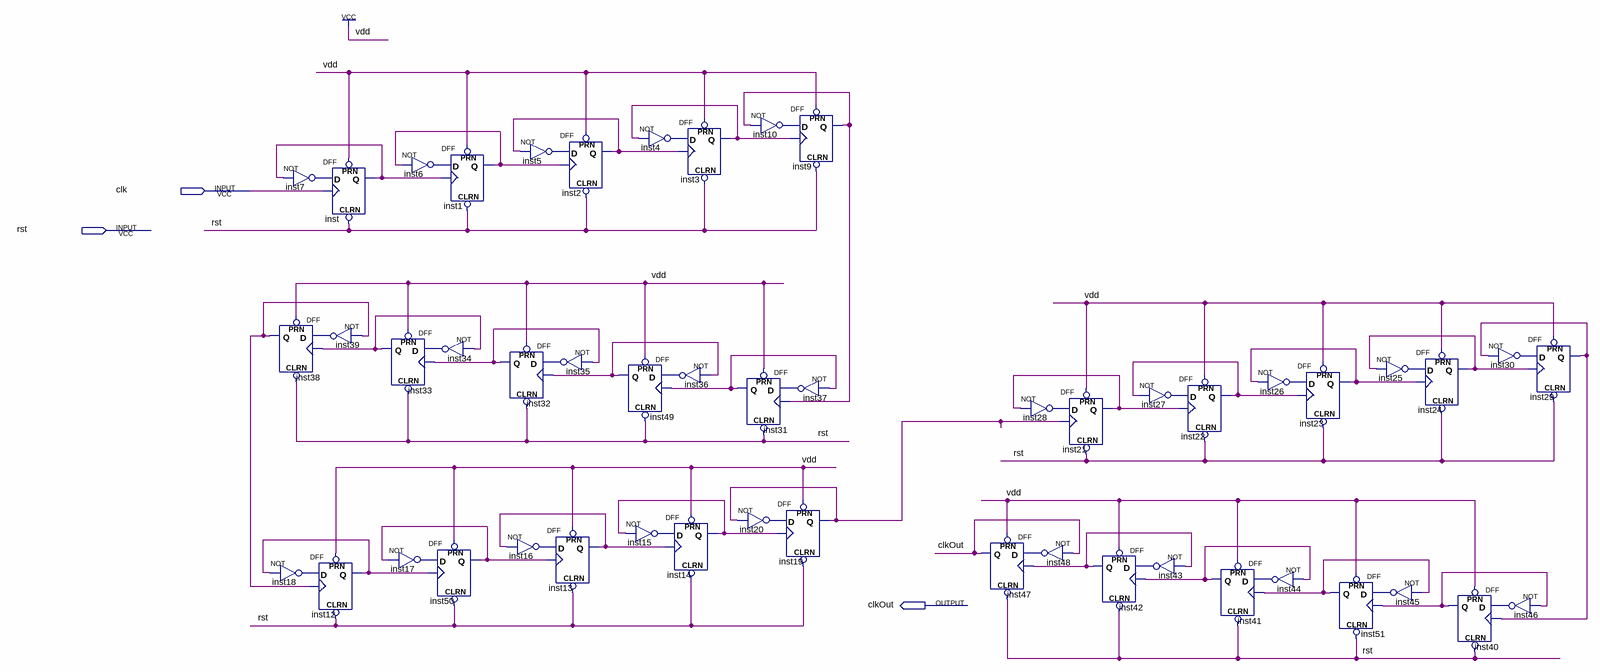
[diagram p0: schematic sheet]
// Quartus schematic DivisorFrequencia.bdf as structural Verilog: 50 symbols, 3 pins
module DivisorFrequencia (
  input  clk,
  input  rst,
  output clkOut
);

  wire inst1_q, inst2_q, inst3_q, inst4_out, inst5_out, inst6_out, inst7_out, inst9_q, inst10_out, inst12_q,
       inst13_q, inst14_q, inst15_out, inst16_out, inst17_out, inst18_out, inst19_q, inst20_out, inst21_q,
       inst22_q, inst23_q, inst24_q, inst25_out, inst26_out, inst27_out, inst28_out, inst29_q, inst30_out,
       inst31_q, inst32_q, inst33_q, inst34_out, inst35_out, inst36_out, inst37_out, inst38_q, inst39_out,
       inst40_q, inst41_q, inst42_q, inst43_out, inst44_out, inst45_out, inst46_out, inst48_out, inst49_q,
       inst50_q, inst51_q, inst_q;

  not inst7 (inst7_out, inst_q);
  DFF inst38 (.CLRN(rst), .CLK(inst33_q), .D(inst39_out), .PRN(1'b1), .Q(inst38_q));
  DFF inst12 (.CLRN(rst), .CLK(inst38_q), .D(inst18_out), .PRN(1'b1), .Q(inst12_q));
  not inst18 (inst18_out, inst12_q);
  DFF inst (.CLRN(rst), .CLK(clk), .D(inst7_out), .PRN(1'b1), .Q(inst_q));
  not inst39 (inst39_out, inst38_q);
  not inst6 (inst6_out, inst1_q);
  DFF inst33 (.CLRN(rst), .CLK(inst32_q), .D(inst34_out), .PRN(1'b1), .Q(inst33_q));
  not inst17 (inst17_out, inst50_q);
  DFF inst1 (.CLRN(rst), .CLK(inst_q), .D(inst6_out), .PRN(1'b1), .Q(inst1_q));
  not inst34 (inst34_out, inst33_q);
  DFF inst50 (.CLRN(rst), .CLK(inst12_q), .D(inst17_out), .PRN(1'b1), .Q(inst50_q));
  not inst5 (inst5_out, inst2_q);
  DFF inst32 (.CLRN(rst), .CLK(inst49_q), .D(inst35_out), .PRN(1'b1), .Q(inst32_q));
  not inst16 (inst16_out, inst13_q);
  DFF inst2 (.CLRN(rst), .CLK(inst1_q), .D(inst5_out), .PRN(1'b1), .Q(inst2_q));
  not inst35 (inst35_out, inst32_q);
  DFF inst13 (.CLRN(rst), .CLK(inst50_q), .D(inst16_out), .PRN(1'b1), .Q(inst13_q));
  DFF inst49 (.CLRN(rst), .CLK(inst31_q), .D(inst36_out), .PRN(1'b1), .Q(inst49_q));
  not inst15 (inst15_out, inst14_q);
  DFF inst3 (.CLRN(rst), .CLK(inst2_q), .D(inst4_out), .PRN(1'b1), .Q(inst3_q));
  not inst4 (inst4_out, inst3_q);
  not inst36 (inst36_out, inst49_q);
  DFF inst14 (.CLRN(rst), .CLK(inst13_q), .D(inst15_out), .PRN(1'b1), .Q(inst14_q));
  not inst10 (inst10_out, inst9_q);
  DFF inst31 (.CLRN(rst), .CLK(inst9_q), .D(inst37_out), .PRN(1'b1), .Q(inst31_q));
  DFF inst19 (.CLRN(rst), .CLK(inst14_q), .D(inst20_out), .PRN(1'b1), .Q(inst19_q));
  not inst20 (inst20_out, inst19_q);
  DFF inst9 (.CLRN(rst), .CLK(inst3_q), .D(inst10_out), .PRN(1'b1), .Q(inst9_q));
  not inst37 (inst37_out, inst31_q);
  DFF inst47 (.CLRN(rst), .CLK(inst42_q), .D(inst48_out), .PRN(1'b1), .Q(clkOut));
  not inst28 (inst28_out, inst21_q);
  not inst48 (inst48_out, clkOut);
  DFF inst21 (.CLRN(rst), .CLK(inst19_q), .D(inst28_out), .PRN(1'b1), .Q(inst21_q));
  DFF inst42 (.CLRN(rst), .CLK(inst41_q), .D(inst43_out), .PRN(1'b1), .Q(inst42_q));
  not inst27 (inst27_out, inst22_q);
  not inst43 (inst43_out, inst42_q);
  DFF inst22 (.CLRN(rst), .CLK(inst21_q), .D(inst27_out), .PRN(1'b1), .Q(inst22_q));
  not inst26 (inst26_out, inst23_q);
  DFF inst41 (.CLRN(rst), .CLK(inst51_q), .D(inst44_out), .PRN(1'b1), .Q(inst41_q));
  DFF inst23 (.CLRN(rst), .CLK(inst22_q), .D(inst26_out), .PRN(1'b1), .Q(inst23_q));
  not inst44 (inst44_out, inst41_q);
  DFF inst51 (.CLRN(rst), .CLK(inst40_q), .D(inst45_out), .PRN(1'b1), .Q(inst51_q));
  DFF inst24 (.CLRN(rst), .CLK(inst23_q), .D(inst25_out), .PRN(1'b1), .Q(inst24_q));
  not inst25 (inst25_out, inst24_q);
  not inst45 (inst45_out, inst51_q);
  DFF inst40 (.CLRN(rst), .CLK(inst29_q), .D(inst46_out), .PRN(1'b1), .Q(inst40_q));
  not inst30 (inst30_out, inst29_q);
  not inst46 (inst46_out, inst40_q);
  DFF inst29 (.CLRN(rst), .CLK(inst24_q), .D(inst30_out), .PRN(1'b1), .Q(inst29_q));
endmodule
